# EAGLE schematic pmod_clock_906 (EAGLE 6.5.4)
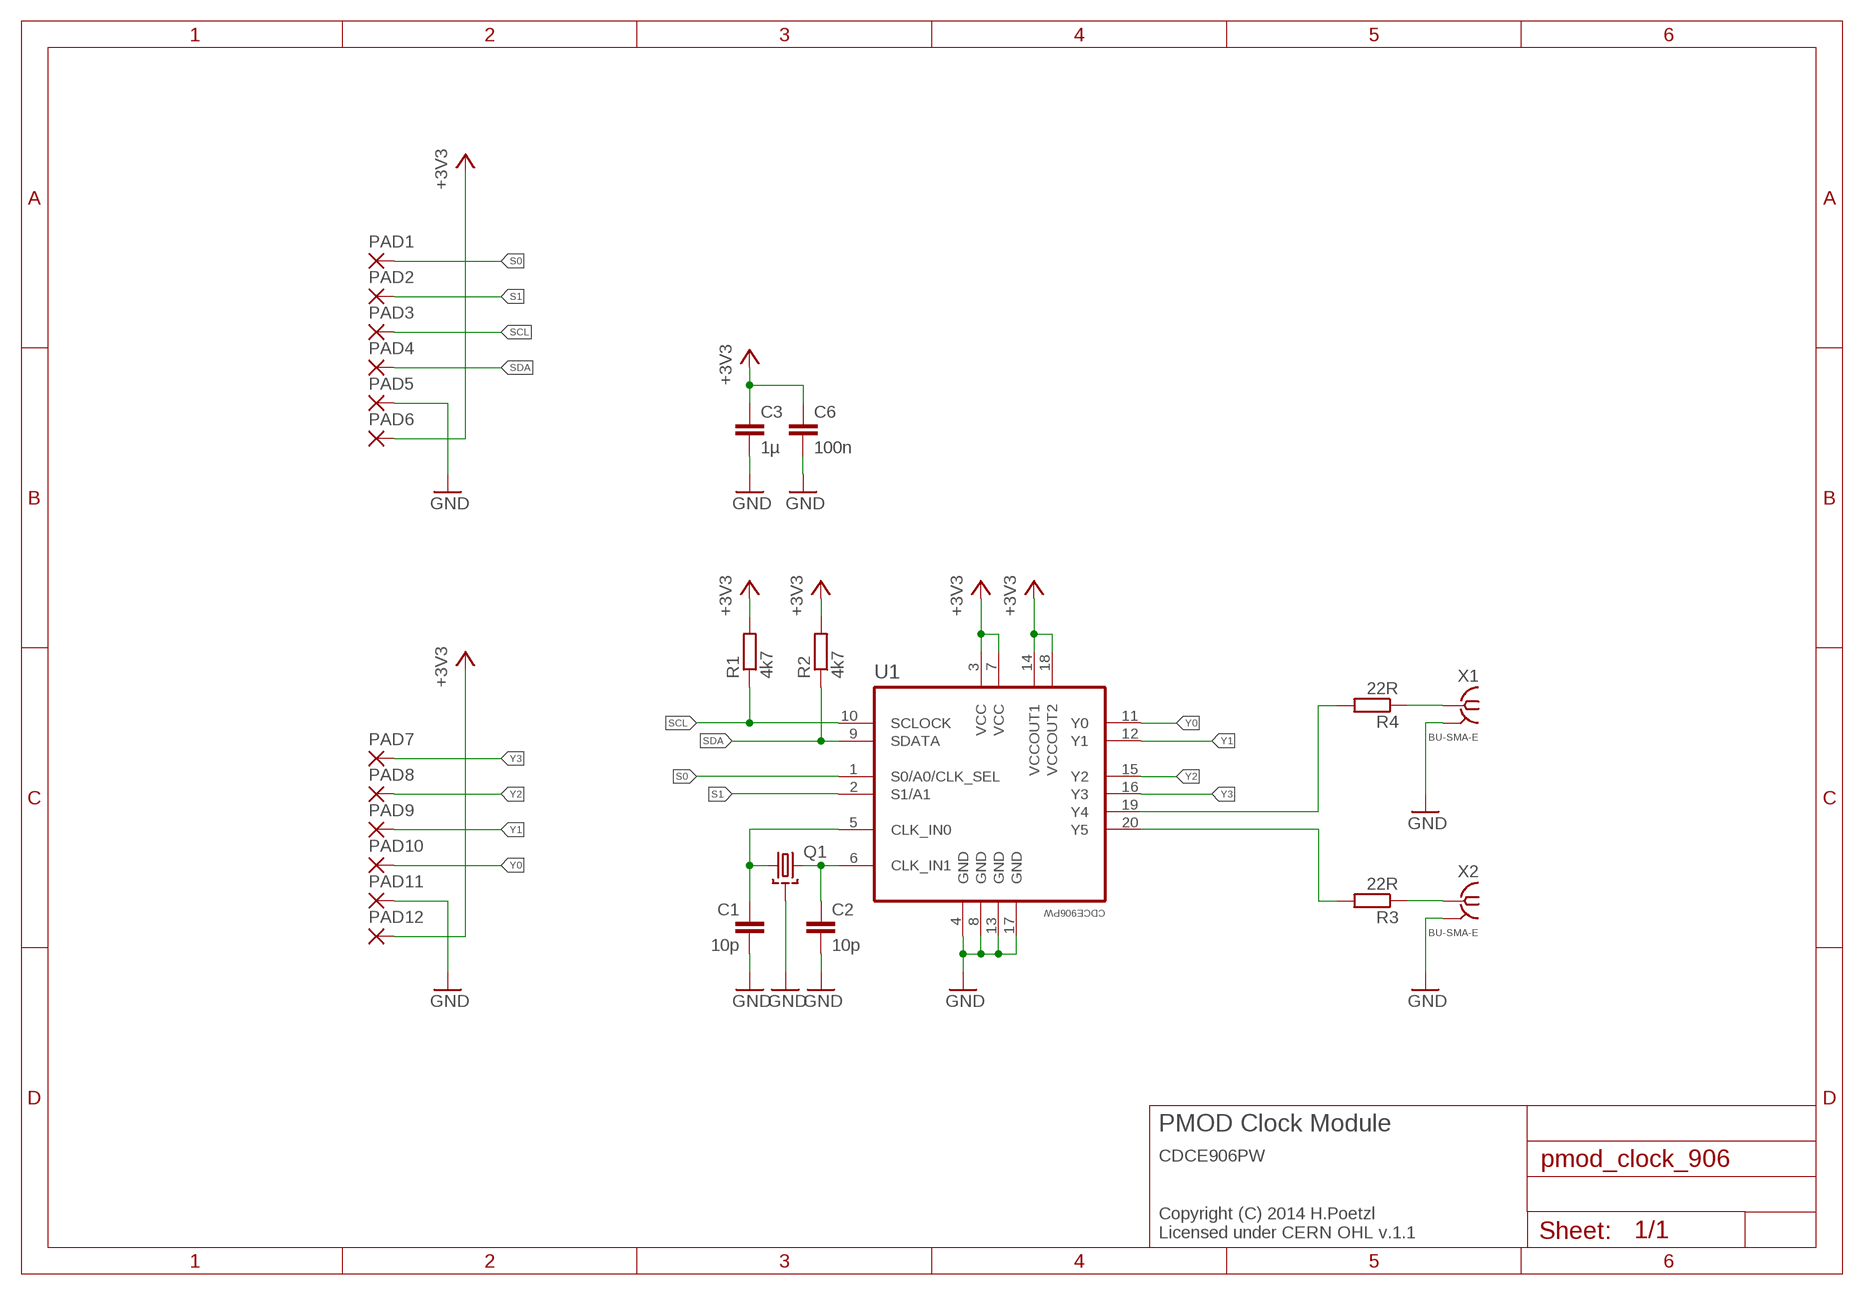
[diagram p0: schematic, sheet 1]

## Parts
C1  10p  C-EUC0402K  [C0402K]
C2  10p  C-EUC0402K  [C0402K]
C3  1µ  C-EUC0402  [C0402]
C6  100n  C-EUC0402  [C0402]
PAD1  SMD2HR  [SMD1.27-3.175HR]
PAD2  SMD2HR  [SMD1.27-3.175HR]
PAD3  SMD2HR  [SMD1.27-3.175HR]
PAD4  SMD2HR  [SMD1.27-3.175HR]
PAD5  SMD2HR  [SMD1.27-3.175HR]
PAD6  SMD2HR  [SMD1.27-3.175HR]
PAD7  SMD2HR  [SMD1.27-3.175HR]
PAD8  SMD2HR  [SMD1.27-3.175HR]
PAD9  SMD2HR  [SMD1.27-3.175HR]
PAD10  SMD2HR  [SMD1.27-3.175HR]
PAD11  SMD2HR  [SMD1.27-3.175HR]
PAD12  SMD2HR  [SMD1.27-3.175HR]
Q1  SMD-4P-2G5.0X3.2+3.2X2.5  [MIX]
R1  4k7  R-EU_R0402  [R0402]
R2  4k7  R-EU_R0402  [R0402]
R3  22R  R-EU_R0402  [R0402]
R4  22R  R-EU_R0402  [R0402]
U1  CDCE906PW  [SOP65P640X120-20N]
X1  BU-SMA-E  [SMA-EDGE]
X2  BU-SMA-E  [SMA-EDGE]

## Nets
+3V3: C3.1 C6.1 PAD6.1(P) PAD12.1(P) R1.2 R2.2 U1.3(VCC) U1.7(VCC) U1.14(VCCOUT1) U1.18(VCCOUT2)
GND: C1.2 C2.2 C3.2 C6.2 PAD5.1(P) PAD11.1(P) Q1.2(GND) Q1.2@(GND) Q1.4(GND) Q1.4@(GND) U1.4(GND) U1.8(GND) U1.13(GND) U1.17(GND) X1.2@3 X1.2@4 X2.2@3 X2.2@4
N$1: C1.1 Q1.1 Q1.1@ U1.5(CLK_IN0)
N$4: C2.1 Q1.3 Q1.3@ U1.6(CLK_IN1)
N$5: R4.1 X1.1
N$6: R3.1 X2.1
N$12: R3.2 U1.20(Y5)
S0: PAD1.1(P) U1.1(S0/A0/CLK_SEL)
S1: PAD2.1(P) U1.2(S1/A1)
SCL: PAD3.1(P) R1.1 U1.10(SCLOCK)
SDA: PAD4.1(P) R2.1 U1.9(SDATA)
Y0: PAD10.1(P) U1.11(Y0)
Y1: PAD9.1(P) U1.12(Y1)
Y2: PAD8.1(P) U1.15(Y2)
Y3: PAD7.1(P) U1.16(Y3)
Y5: R4.2 U1.19(Y4)

## Notes on the sheet
- PMOD Clock Module
- CDCE906PW
- Copyright (C) 2014 H.Poetzl
  Licensed under CERN OHL v.1.1

## Library data of the parts
C1-C3 C6 = rcl:C-EU: CAPACITOR, European symbol
PAD1-PAD12 = wirepad:SMD2: SMD PAD
Q1 = xtal:SMD-4P-2G
R1-R4 = rcl:R-EU_: RESISTOR, European symbol
U1 = cdce906:CDCE906: PROGRAMMABLE 3-PLL CLOCK SYNTHESIZER / MULTIPLIER / DIVIDER; MPN: CDCE906PW; OC_FARNELL: 1791641; OC_NEWARK: 06M7226; PACKAGE: TSSOP-20; SUPPLIER: Texas Instruments
X1 X2 = sma:BU-SMA-E